# EAGLE design WiFiRadio (EAGLE 7.7.0)
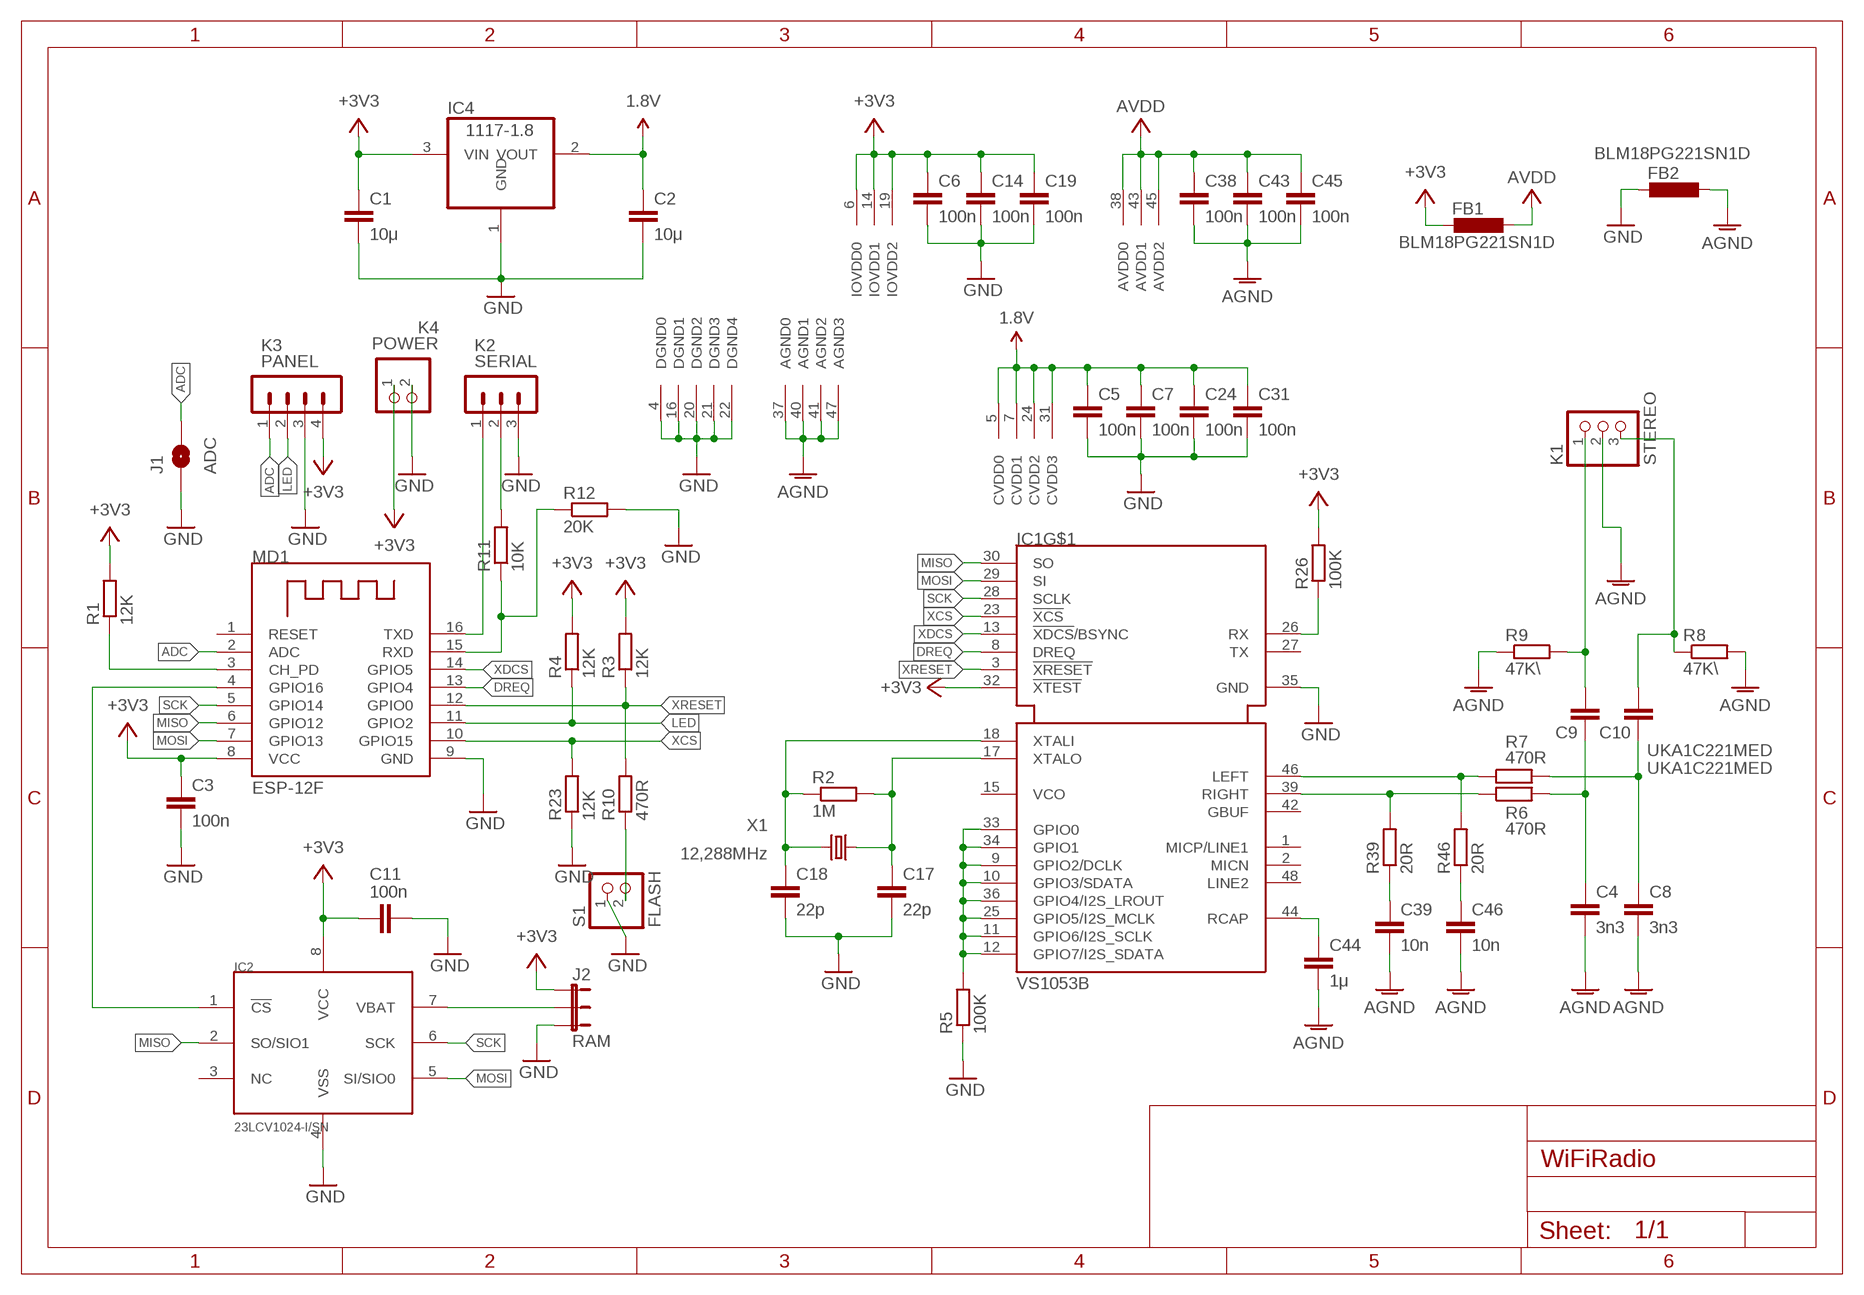
[diagram p0: schematic, sheet 1]

## Parts
C1  10μ  C-EUC0805  [C0805]
C2  10μ  C-EUC0805  [C0805]
C3  100n  C-EUC0603  [C0603]
C4  3n3  C-EUC0805  [C0805]
C5  100n  C-EUC0603  [C0603]
C6  100n  C-EUC0603  [C0603]
C7  100n  C-EUC0603  [C0603]
C8  3n3  C-EUC0805  [C0805]
C9  UKA1C221MED  C-EUC0805  [C0805]
C10  UKA1C221MED  C-EUC0805  [C0805]
C11  100n  C-EUC0603  [C0603]
C14  100n  C-EUC0603  [C0603]
C17  22p  C-EUC0805  [C0805]
C18  22p  C-EUC0805  [C0805]
C19  100n  C-EUC0603  [C0603]
C24  100n  C-EUC0603  [C0603]
C31  100n  C-EUC0603  [C0603]
C38  100n  C-EUC0603  [C0603]
C39  10n  C-EUC0805  [C0805]
C43  100n  C-EUC0603  [C0603]
C44  1μ  C-EUC0805  [C0805]
C45  100n  C-EUC0603  [C0603]
C46  10n  C-EUC0805  [C0805]
FB1  BLM18PG221SN1D  L-EUL2012C  [L2012C]
FB2  BLM18PG221SN1D  L-EUL2012C  [L2012C]
IC1  VS1053B  [LQFP48]
IC2  23LCV1024-I/SN  [SO-08]
IC4  1117-1.8  REG1117  [SOT223]
J1  ADC  SOLDERJUMPER-OLDNC  [SJ_2S]
J2  RAM  JUMPER-3SMD  [SJ_3]
K1  STEREO  PINHD-1X3  [1X03]
K2  SERIAL  MA03-1  [MA03-1]
K3  PANEL  MA04-1  [MA04-1]
K4  POWER  PINHD-1X2  [1X02]
MD1  ESP-12F  [ESP-12F]
R1  12K  R-EU_R0805  [R0805]
R2  1M  R-EU_R0805  [R0805]
R3  12K  R-EU_R0805  [R0805]
R4  12K  R-EU_R0805  [R0805]
R5  100K  R-EU_R0805  [R0805]
R6  470R  R-EU_R0805  [R0805]
R7  470R  R-EU_R0805  [R0805]
R8  47K\  R-EU_R0805  [R0805]
R9  47K\  R-EU_R0805  [R0805]
R10  470R  R-EU_R0805  [R0805]
R11  10K  R-EU_R0603  [R0603]
R12  20K  R-EU_R0603  [R0603]
R23  12K  R-EU_R0805  [R0805]
R26  100K  R-EU_R0805  [R0805]
R39  20R  R-EU_R0805  [R0805]
R46  20R  R-EU_R0805  [R0805]
S1  FLASH  PINHD-1X2  [1X02]
X1  12,288MHz  CRYSTALHC49S  [HC49/S]

## Nets
1.8V: C2.1 C5.1 C7.1 C24.1 C31.1 IC1.5(CVDD0) IC1.7(CVDD1) IC1.24(CVDD2) IC1.31(CVDD3) IC4.2(VOUT)
+3V3: C1.1 C3.1 C6.1 C11.1 C14.1 C19.1 FB1.2 IC1.6(IOVDD0) IC1.14(IOVDD1) IC1.19(IOVDD2) IC1.32(!XTEST) IC2.8(VCC) IC4.3(VIN) J2.1 K3.4 K4.1 MD1.8(VCC) R1.2 R3.2 R4.2 R26.2
ADC: J1.2 K3.1 MD1.2(ADC)
AGND: C4.2 C8.2 C38.2 C39.2 C43.2 C44.2 C45.2 C46.2 FB2.1 IC1.37(AGND0) IC1.40(AGND1) IC1.41(AGND2) IC1.47(AGND3) K1.2 R8.2 R9.1
DREQ: IC1.8(DREQ) MD1.13(GPIO4)
GND: C1.2 C2.2 C3.2 C5.2 C6.2 C7.2 C11.2 C14.2 C17.2 C18.2 C19.2 C24.2 C31.2 FB2.2 IC1.4(DGND0) IC1.16(DGND1) IC1.20(DGND2) IC1.21(DGND3) IC1.22(DGND4) IC1.35(GND) IC2.4(VSS) IC4.1(GND) J1.1 J2.3 K2.3 K3.3 K4.2 MD1.9(GND) R5.1 R12.2 R23.1 S1.1
GPIO: IC1.9(GPIO2/DCLK) IC1.10(GPIO3/SDATA) IC1.11(GPIO6/I2S_SCLK) IC1.12(GPIO7/I2S_SDATA) IC1.25(GPIO5/I2S_MCLK) IC1.33(GPIO0) IC1.34(GPIO1) IC1.36(GPIO4/I2S_LROUT) R5.2
LED: K3.2 MD1.11(GPIO2) R4.1
LEFT: IC1.46(LEFT) R7.1 R46.2
MISO: IC1.30(SO) IC2.2(SO/SIO1) MD1.6(GPIO12)
MOSI: IC1.29(SI) IC2.5(SI/SIO0) MD1.7(GPIO13)
N$1: IC2.1(!CS) MD1.4(GPIO16)
N$2: MD1.3(CH_PD) R1.1
N$4: C17.1 IC1.17(XTALO) R2.2 X1.1
N$5: C18.1 IC1.18(XTALI) R2.1 X1.2
N$6: K2.2 R11.2
N$7: C4.1 C9.1 R6.2
N$8: C8.1 C10.1 R7.2
N$9: IC2.7(VBAT) J2.2
N$10: C39.1 R39.1
N$11: C46.1 R46.1
N$14: C9.2 K1.1 R9.2
N$15: C10.2 K1.3 R8.1
N$18: R10.1 S1.2
RCAP: C44.1 IC1.44(RCAP)
RIGHT: IC1.39(RIGHT) R6.1 R39.2
RX: IC1.26(RX) R26.1
RXD: MD1.15(RXD) R11.1 R12.1
SCK: IC1.28(SCLK) IC2.6(SCK) MD1.5(GPIO14)
TXD: K2.1 MD1.16(TXD)
V+: C38.1 C43.1 C45.1 FB1.1 IC1.38(AVDD0) IC1.43(AVDD1) IC1.45(AVDD2) ; supply symbol labelled AVDD
XCS: IC1.23(!XCS) MD1.10(GPIO15) R23.2
XDCS: IC1.13(!XDCS!/BSYNC) MD1.14(GPIO5)
XRESET: IC1.3(!XRESET) MD1.12(GPIO0) R3.1 R10.2
Unconnected: IC1.1(MICP/LINE1) IC1.2(MICN) IC1.15(VCO) IC1.27(TX) IC1.42(GBUF) IC1.48(LINE2) IC2.3(NC) MD1.1(RESET)

## Library data of the parts
C1-C11 C14 C17-C19 C24 C31 C38 C39 C43-C46 = rcl:C-EU: CAPACITOR, European symbol
FB1 FB2 = rcl:L-EU: INDUCTOR, European symbol
IC1 = VS1053b:VS1053B: VS1053b VS1053b is an Ogg Vorbis/MP3/AAC/WMA/ FLAC/WAVMIDI audio decoder as well as an PCM/IMA ADPCM/Ogg Vorbis encoder on a single chip. It contains a high-performance, proprietary low-power DSP processor core VS_DSP4, data memory, 16 KiB instruction RAM and 0.5+ KiB data RAM for user appli- cationsrunningsimultaneouslywithanybuilt- in decoder, serial control and input data in- terfaces, upto 8 general purpose I/O pins, an UART, as well as a high-quality variable-sample- rate stereo ADC (mic, line, line + mic or 2×line) and stereo DAC, followed by an earphone am- plifier and a common voltage buffer.
IC2 = 23LCV1024:23LCV1024: 1 Mbit SPI Serial SRAM with Battery Backup and SDI Interface
IC4 = burr-brown:REG1117: 800mA and 1A Low Dropout (LDO) Positive Regulator 1.8V, 2.5V, 2.85V, 3.3V, 5V, and Adj; MPN: REG1117; OC_FARNELL: 1097566; OC_NEWARK: 14P6981
J1 = SparkFun-Retired:SOLDERJUMPER-OLD: Solder Jumper Standard SMD solder jumper. Used to automate production. Two varients : Normally Open and Normally Closed are the same, but have different paste layers. NC will have a large amount of paste and should jumper during reflow.
J2 = SparkFun-Retired:JUMPER-3
K1 = pinhead:PINHD-1X3: PIN HEADER
K2 = con-lstb:MA03-1: PIN HEADER; OC_FARNELL: unknown; OC_NEWARK: unknown
K3 = con-lstb:MA04-1: PIN HEADER; OC_FARNELL: unknown; OC_NEWARK: unknown
K4 S1 = pinhead:PINHD-1X2: PIN HEADER
MD1 = ESP-12F:ESP-12F
R1-R12 R23 R26 R39 R46 = rcl:R-EU_: RESISTOR, European symbol
X1 = crystal:CRYSTAL: CRYSTAL; OC_FARNELL: 1667008; OC_NEWARK: unknown

## Board
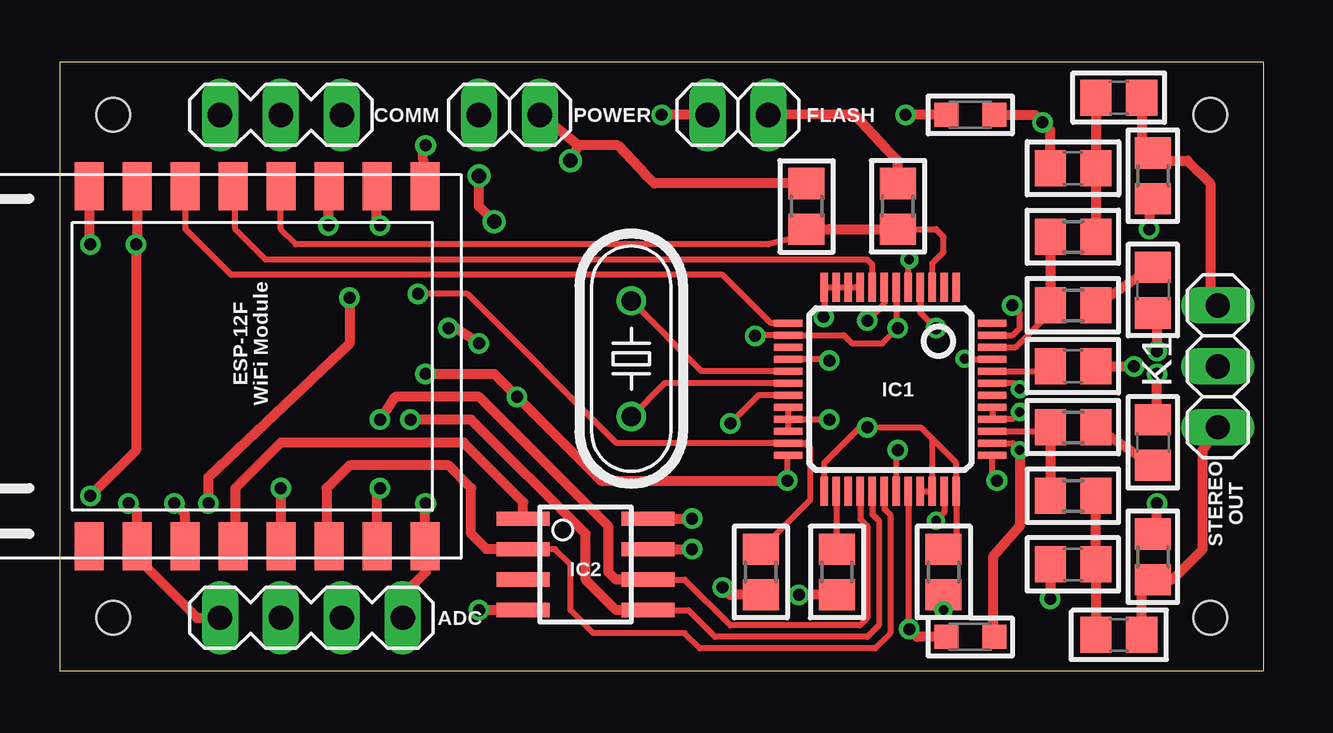
[diagram p1: board, top side]
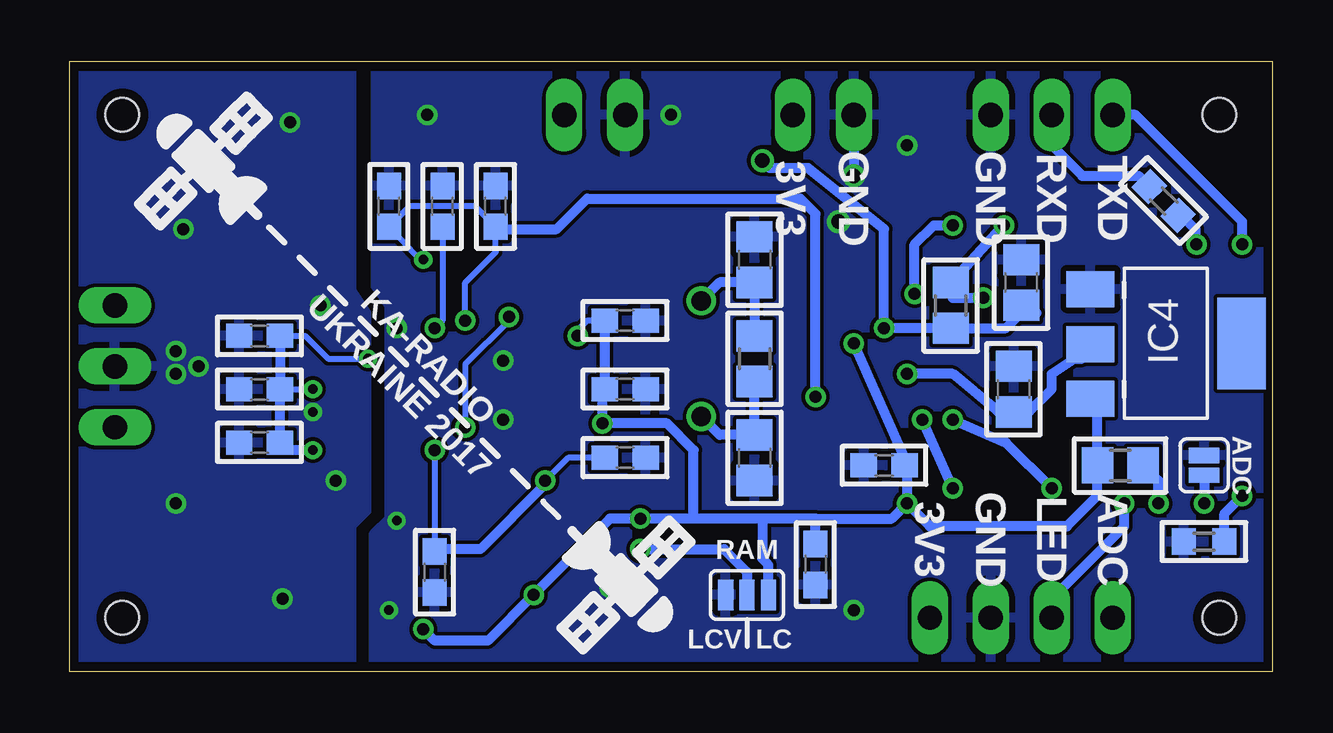
[diagram p2: board, bottom side, seen from below]

Size 50.16 x 25.4 mm. Coordinates in mm from the lower left corner, seen from the top.
Outline: 0,25.4 50.16,25.4 50.16,0 0,0 0,25.4
Copper layers (1*16): Top 0.0356mm / dielectric 1.5011mm / Bottom 0.0356mm
Design rules "oshpark-2layer *": minimum track width 6mil, minimum drill 13mil, track to track 6mil, track to pad 6mil, pad to pad 6mil, via to via 6mil, smd to smd 6mil, copper to edge 15mil, drill to drill 6mil, minimum pad ring 7mil, minimum via ring 7mil, stop-mask expansion 2.5mil, vias tented up to drill 20mil, thermal gap 10mil
Holes 1.4 mm at 47.94,23.18 47.94,2.22 2.22,23.18 2.22,2.22

### Footprints (pad centres in the part's own frame; a part is rotated, then mirrored left to right if it is on the bottom)
C0805 = smd 1.3 x 1.5: 1 -0.95,0; 2 0.95,0
C0603 = smd 1.1 x 1: 1 -0.85,0; 2 0.85,0
L2012C = smd 1 x 1: 1 -1,0; 2 1,0
LQFP48 = smd 0.3 x 1.2: 1 -2.75,-4.25; 2 -2.25,-4.25; 3 -1.75,-4.25; 4 -1.25,-4.25; 5 -0.75,-4.25; 6 -0.25,-4.25; 7 0.25,-4.25; 8 0.75,-4.25; 9 1.25,-4.25; 10 1.75,-4.25; 11 2.25,-4.25; 12 2.75,-4.25; 25 2.75,4.25; 26 2.25,4.25; 27 1.75,4.25; 28 1.25,4.25; 29 0.75,4.25; 30 0.25,4.25; 31 -0.25,4.25; 32 -0.75,4.25; 33 -1.25,4.25; 34 -1.75,4.25; 35 -2.25,4.25; 36 -2.75,4.25 | smd 1.2 x 0.3: 13 4.25,-2.75; 14 4.25,-2.25; 15 4.25,-1.75; 16 4.25,-1.25; 17 4.25,-0.75; 18 4.25,-0.25; 19 4.25,0.25; 20 4.25,0.75; 21 4.25,1.25; 22 4.25,1.75; 23 4.25,2.25; 24 4.25,2.75; 37 -4.25,2.75; 38 -4.25,2.25; 39 -4.25,1.75; 40 -4.25,1.25; 41 -4.25,0.75; 42 -4.25,0.25; 43 -4.25,-0.25; 44 -4.25,-0.75; 45 -4.25,-1.25; 46 -4.25,-1.75; 47 -4.25,-2.25; 48 -4.25,-2.75
SO-08 = smd 0.6 x 2.2: 1 -1.905,-2.6; 2 -0.635,-2.6; 3 0.635,-2.6; 4 1.905,-2.6; 5 1.905,2.6; 6 0.635,2.6; 7 -0.635,2.6; 8 -1.905,2.6
SOT223 = smd 1.499 x 2.007: 1 -2.261,-3.15; 2 0.025,-3.15; 3 2.311,-3.15 | smd 3.81 x 2.007: 4 0,3.15
SJ_2S = smd 0.635 x 1.27: 1 -0.412,0; 2 0.412,0
SJ_3 = smd 0.635 x 1.27: 1 -0.889,0; 2 0,0; 3 0.889,0
1X03 = drill 1.016 long: 1 -2.54,0; 2 0,0; 3 2.54,0
MA03-1 = drill 1.016 long: 1 -2.54,0; 2 0,0; 3 2.54,0
MA04-1 = drill 1.016 long: 1 -3.81,0; 2 -1.27,0; 3 1.27,0; 4 3.81,0
1X02 = drill 1.016 long: 1 -1.27,0; 2 1.27,0
ESP-12F = smd 2 x 1.2: 1 -7.5,4.5; 2 -7.5,2.5; 3 -7.5,0.5; 4 -7.5,-1.5; 5 -7.5,-3.5; 6 -7.5,-5.5; 7 -7.5,-7.5; 8 -7.5,-9.5; 9 7.5,-9.5; 10 7.5,-7.5; 11 7.5,-5.5; 12 7.5,-3.5; 13 7.5,-1.5; 14 7.5,0.5; 15 7.5,2.5; 16 7.5,4.5
R0805 = smd 1.3 x 1.5: 1 -0.95,0; 2 0.95,0
R0603 = smd 1 x 1.1: 1 -0.85,0; 2 0.85,0
HC49/S = drill 0.813: 1 -2.413,0; 2 2.413,0

### Placement (x,y rotation side)
C1  10.48,16.19 90 bottom
C2  10.79,11.75 90 bottom
C3  16.19,8.57 180 bottom
C4  42.23,4.45 180 top
C5  36.83,19.37 90 bottom
C6  34.61,19.37 90 bottom
C7  32.38,19.37 90 bottom
C8  42.23,20.95 180 top
C9  44.13,1.51 0 top
C10  44.13,23.89 0 top
C11  19.05,4.45 270 bottom
C14  26.99,14.61 0 bottom
C17  21.59,17.14 90 bottom
C18  21.59,8.89 270 bottom
C19  26.99,11.75 0 bottom
C24  26.99,8.89 0 bottom
C31  34.92,4.13 270 bottom
C38  42.23,13.97 180 bottom
C39  45.56,9.53 90 top
C43  42.23,9.53 180 bottom
C44  42.23,12.7 0 top
C45  42.23,11.75 180 bottom
C46  45.56,15.88 270 top
FB1  37.94,1.43 180 top
FB2  37.94,23.18 180 top
IC1  34.61,11.75 180 top
IC2  21.91,4.45 270 top
IC4  4.45,13.65 270 bottom
J1  2.86,8.57 270 bottom
J2  21.91,3.17 180 bottom
K1  48.26,12.7 90 top
K2  9.21,23.18 0 top
K3  10.48,2.22 0 top
K4  18.73,23.18 180 top
MD1  5.71,12.7 90 top
R1  6.35,8.57 180 bottom
R2  21.59,13.02 90 bottom
R3  31.11,19.37 90 top
R4  13.41,15.24 270 bottom
R5  36.83,4.13 90 top
R6  42.23,7.3 0 top
R7  42.23,18.1 0 top
R8  45.56,20.64 270 top
R9  45.56,4.76 270 top
R10  34.92,19.37 270 top
R11  4.54,19.59 135 bottom
R12  2.86,5.4 180 bottom
R23  29.21,4.13 90 top
R26  32.38,4.13 270 top
R39  42.23,10.16 180 top
R46  42.23,15.24 180 top
S1  28.26,23.18 0 top
X1  23.81,13.02 270 top

### Tracks (layer width: path | path; a pad name or v marks a point on that pad's centre or on a via)
1.8V  (via drill 0.4, 0.5)
  Top 0.254: IC1.31 34.86,9.14 v34.92,9.21 | IC1.5 35.36,17.1 v35.4,17.14 | v30.32,7.94 30.32,8.96 IC1.24 | IC1.7 34.36,15.31 v33.66,14.61
  Top 0.406: v15.24,12.38 18.1,12.38 v19.05,11.43 22.54,7.94 v30.32,7.94
  Bottom 0.254: v34.92,9.21 C31.1 | C24.1 29.37,8.89 v30.32,7.94 | v35.4,17.14 35.56,17.14 C5.1 35.98,19.37 33.23,19.37 C7.1 32.38,17.46 33.66,16.19 v33.66,14.61
  Bottom 0.406: C31.1 34.92,5.08 33.02,5.08 30.32,7.78 v30.32,7.94 | C7.1 32.38,18.41 29.84,18.41 28.57,19.68 19.68,19.68 19.05,19.05 v19.05,11.43 | v15.24,12.38 13.34,12.38 11.43,10.8 C2.1 10.16,10.8 9.21,11.75 9.21,12.38 8.26,13.02 7.94,13.02 7.62,13.97 IC4.2
+3V3  (via drill 0.5, 0.6)
  Top 0.254: IC1.6 34.86,14.36 v34.92,14.29 34.29,13.65 33.02,13.65 32.67,14 IC1.14 29,14 v28.97,13.97 | IC1.19 29.12,11.5 v27.94,10.32 | IC1.32 35.36,1.79 v35.4,1.75
  Top 0.406: v15.24,6.99 15.21,6.96 MD1.8 15.24,5.17 15.24,4.13 14.29,3.17 K3.4 | IC2.8 v26.35,6.35 | R26.2 v30.8,3.17 | FB1.2 35.72,1.43 v35.4,1.75 | v16.2,14.29 16.51,14.29 v17.46,13.65 | 21.59,21.91 23.26,21.91 24.45,20.64 24.77,20.32 R3.2 | 21.59,21.91 K4.1 | 21.59,21.91 v21.27,21.27
  Bottom 0.254: C6.1 34.61,14.61 v34.92,14.29 | C14.1 28.57,14.61 28.97,14.21 v28.97,13.97
  Bottom 0.406: C19.1 27.94,11.75 | C19.1 C14.1 | 24.13,6.35 24.13,9.21 25.24,10.32 v27.94,10.32 27.94,11.64 C19.1 | v15.24,6.99 15.24,8.57 C3.1 15.24,8.68 v17.46,13.65 | v15.24,6.99 15.88,6.35 19.05,6.35 | 19.05,6.35 21.27,6.35 | 21.27,6.35 24.13,6.35 | 24.13,6.35 v26.35,6.35 27.62,6.35 v30.8,3.17 32.7,1.27 34.92,1.27 v35.4,1.75 | 27.94,11.74 C19.1 | R1.2 7.3,7.3 8.57,6.03 14.29,6.03 v15.24,6.99 | R1.2 | v21.27,21.27 20.95,20.95 19.37,20.95 16.19,18.41 v16.2,14.29 R4.2 11.11,14.29 10.48,14.92 9.85,14.92 C1.1 | J2.1 21.02,4.43 21.27,4.68 21.27,6.35 | C11.1 19.05,6.35 | IC4.3 7.3,11.43 R1.2
ADC  (via drill 0.5)
  Top 0.406: K3.1 5.71,2.22 3.21,4.72 MD1.2 3.21,6.63 v2.86,6.99
  Bottom 0.406: J1.2 v2.86,6.99
AGND  (via drill 0.4, 0.5)
  Top 0.254: IC1.41 IC1.40 39.71,10.5 v40.01,10.79 | v39.05,7.94 38.86,8.13 IC1.37 | IC1.47 39.72,14 40.01,14.29 40.01,14.92 v39.69,15.24
  Top 0.406: R8.2 45.41,19.37 v45.4,18.41 | R9.1 45.72,5.71 v45.72,6.99 | C46.2 45.72,14.61 v45.72,13.34 | C39.2 45.72,10.16 v45.72,12.38 | C44.2 v44.77,12.7 | C4.2 v41.28,3.02 v41.27,3.02 | FB2.1 40.64,23.18 v40.96,22.86 41.28,22.54 C8.2
  pour Bottom: 38.42,25.88 38.42,15.88 37.78,14.92 37.78,6.67 38.42,6.03 38.42,-0.32 50.16,-0.32 50.16,25.72
DREQ
  Top 0.254: MD1.13 7.3,20.11 7.3,18.41 8.57,17.14 33.66,17.14 33.86,16.94 IC1.8
GND  (via drill 0.4, 0.5, 0.6)
  Top 0.254: IC1.22 IC1.21 | IC1.21 IC1.20 | v32.07,10.48 30.38,10.48 IC1.21 | IC1.35 36.86,6.62 v36.51,6.27 | IC1.4 35.86,14.94 v36.51,14.29 | R5.1 v36.83,2.54 | IC1.16 30.38,13.02 31.99,13.02 arc-90 v32.07,12.94
  Top 0.406: FB2.2 v35.24,23.18 | IC2.4 v17.46,2.54 | R23.1 27.94,3.18 v27.62,3.49 | S1.1 v25.08,23.18 | MD1.9 15.12,21.79 v15.24,21.91 | v17.46,20.64 17.46,19.37 v18.1,18.73
  Bottom 0.406: K4.2 v17.46,20.64
  pour Bottom: 37.39,25.72 37.39,16.03 36.83,15.24 36.83,6.35 37.47,5.71 37.47,-0.32 -0.32,-0.32 -0.32,25.72
GPIO  (via drill 0.5)
  Top 0.254: R5.2 37.36,5.29 IC1.36 37.36,8.68 36.36,9.68 | IC1.33 IC1.34 36.36,9.68 | IC1.25 31.86,8.68 33.34,10.16 v33.66,10.16 35.88,10.16 36.36,9.68 | 33.14,16 IC1.9 IC1.10 IC1.11 IC1.12 31.86,14.79 v31.83,14.76
  Bottom 0.254: v33.66,10.16 33.66,12.78 31.83,14.61 v31.83,14.76
LED  (via drill 0.5)
  Top 0.406: v11.19,18.57 11.19,20.18 MD1.11 | v12.06,15.56 12.06,13.65 6.19,8.1 v6.19,6.99
  Bottom 0.406: v11.19,18.57 11.51,18.26 R4.1 13.33,15.55 v12.06,15.56 | K3.2 9.21,3.02 6.19,6.03 v6.19,6.99
LEFT
  Top 0.254: IC1.46 39.85,13.5 40.96,14.61 40.96,14.92 R46.2
  Top 0.406: R7.1 R46.2
MISO
  Top 0.254: IC1.30 34.36,6.76 34.61,6.51 34.61,1.59 33.97,0.95 26.67,0.95 26.04,1.59 22.23,1.59 21.27,2.54 21.27,4.45 20.64,5.08 IC2.2
  Top 0.406: IC2.2 17.78,5.08 17.14,5.71 17.14,7.62 16.19,8.57 12.06,8.57 11.11,7.62 11.11,5.3 MD1.6
MOSI  (via drill 0.5)
  Top 0.254: IC1.29 33.86,6.54 34.13,6.27 34.13,1.91 33.66,1.43 27.3,1.43 26.19,2.54 IC2.5
  Top 0.406: IC2.5 23.18,2.54 21.91,3.81 21.91,5.71 17.14,10.48 v14.61,10.48 | MD1.7 13.21,7.5 v13.34,7.62
  Bottom 0.406: v13.34,7.62 v14.61,10.48
N$1
  Top 0.406: IC2.1 19.31,7.04 16.83,9.53 9.21,9.53 7.3,7.62 7.3,5.29 MD1.4
N$2  (via drill 0.5)
  Top 0.406: MD1.3 5.21,6.53 v4.76,6.99
  Bottom 0.406: R1.1 4.76,7.93 v4.76,6.99
N$4
  Top 0.254: IC1.17 26.75,12.5 X1.1
  Bottom 0.406: X1.1 23.05,16.2 C17.1 R2.2
N$5
  Top 0.254: IC1.18 25.21,12 X1.2
  Bottom 0.406: X1.2 23.05,9.84 C18.1 R2.1
N$6
  Bottom 0.406: K2.2 9.21,21.91 7.94,20.64 5.58,20.64 R11.2
N$7
  Top 0.406: R6.2 C4.1 C9.1
N$8
  Top 0.406: C10.1 C8.1 R7.2
N$9  (via drill 0.5)
  Top 0.406: IC2.7 v26.35,5.08
  Bottom 0.406: v26.35,5.08 22.86,5.08 21.91,4.13 J2.2
N$10
  Top 0.406: R39.1 C39.1
N$11
  Top 0.406: R46.1 C46.1
N$14
  Top 0.406: C9.2 45.09,1.59 45.09,3.17 45.4,3.81 R9.2 45.72,3.81 46.35,3.81 47.62,5.08 47.62,9.21 K1.1
N$15
  Top 0.406: C10.2 45.09,23.81 45.09,21.91 45.4,21.27 R8.1 45.72,21.27 46.99,21.27 47.94,20.32 47.94,15.88 K1.3
N$18
  Top 0.406: R10.1 34.93,21.27 34.45,21.75 33.1,23.19 S1.2
RCAP
  Top 0.254: IC1.44 41.08,12.5 C44.1
RIGHT
  Top 0.254: IC1.39 41.12,10 R39.2
  Top 0.406: R39.2 R6.1
RX
  Top 0.254: IC1.26 32.36,5.11 R26.1
RXD  (via drill 0.5)
  Top 0.406: MD1.15 3.21,17.82 v3.17,17.78 3.17,9.21 v1.27,7.3
  Bottom 0.406: R11.1 3.79,18.99 3.21,18.41 3.21,17.82 v3.17,17.78 | R12.1 2.01,6.57 v1.27,7.3
SCK  (via drill 0.5)
  Top 0.254: IC1.28 33.36,6.33 33.66,6.03 33.66,2.22 33.34,1.91 27.94,1.91 26.04,3.81 IC2.6
  Top 0.406: IC2.6 23.18,3.81 22.86,4.13 22.86,6.03 17.46,11.43 13.97,11.43 v13.34,10.48 | MD1.5 v9.21,7.61 v9.21,7.62
  Bottom 0.406: v13.34,10.48 11.11,9.53 v9.21,7.62
TXD  (via drill 0.5)
  Top 0.406: MD1.16 1.22,17.84 v1.27,17.78
  Bottom 0.406: v1.27,17.78 1.27,18.73 5.71,23.18 K2.1
V+  (via drill 0.4)
  Top 0.254: IC1.38 39.72,9.5 v40.01,9.21 | v40.01,11.75 39.76,12 IC1.43 | v37.7,13.02 37.8,13 IC1.45
  Top 0.406: v40.01,9.21 40.01,6.03 38.89,4.76 38.89,1.48 FB1.1
  Bottom 0.254: C45.1 v40.01,11.75 | v37.7,13.02 39.37,13.02 40.32,13.97 C38.1
  Bottom 0.406: C38.1 C45.1 C43.1 40.96,9.21 v40.01,9.21
XCS  (via drill 0.5)
  Top 0.254: 13.34,20.08 MD1.10 13.18,20.16 | v14.92,15.72 16.99,15.72 23.2,9.5 IC1.23 31.06,9.5 31.27,9.29 31.27,7.14 R23.2
  Top 0.406: 13.18,20.16 13.18,18.73 v13.34,18.57
  Bottom 0.406: v14.92,15.72 14.92,17.78 14.13,18.57 v13.34,18.57
XDCS
  Top 0.254: IC1.13 29.64,14.5 27.62,16.51 7.14,16.51 5.24,18.41 5.24,20.18 MD1.14 5.24,20.22
XRESET
  Top 0.254: IC1.3 36.36,16.99 36.83,17.46 36.83,18.1 36.51,18.41 R10.2 | 32.07,18.42 | 32.07,18.42 29.53,17.78 9.84,17.78 9.21,18.41 MD1.12 | 32.07,18.42 32.07,18.41 32.07,18.42
  Top 0.406: R3.1 32.07,18.42 R10.2

### Text on the board
tPlace: COMM | POWER | FLASH | ESP-12F / WiFi Module | STEREO / OUT | ADC
bPlace: TXD / RXD / GND | GND | 3V3 | KA-RADIO / UKRAINE 2017 | ADC / LED / GND / 3V3
bNames: ADC | RAM | LC | LCV